# Altium project RegistrationModule.PrjPCB (part 4 of 4)

## Sheet Amplifier2ch.SchDoc
size A4; PageSetup: Record=PageOptions|CenterHorizontal=True|CenterVertical=True|PrintScale=0.97|XCorrection=1.00|YCorrection=1.00|PrintKind=2|BorderSize=5000000|LeftOffset=0|BottomOffset=0|Orientation=2|PaperLength=1270|PaperWidth=1000|Scale=100|PaperSource=4|PrintQuality=600|MediaType=1|DitherType=10|PaperKind=A4|PrintScaleMode=1
Used 16 times, as channels TopAmplifier/CH1, TopAmplifier/CH2, TopAmplifier/CH3, TopAmplifier/CH4, TopAmplifier/CH5, TopAmplifier/CH6, TopAmplifier/CH7, TopAmplifier/CH8, TopAmplifier/CH9, TopAmplifier/CH10, TopAmplifier/CH11, TopAmplifier/CH12, TopAmplifier/CH13, TopAmplifier/CH14, TopAmplifier/CH15, TopAmplifier/CH16. Parts and nets are listed once, with the designators drawn on the sheet.
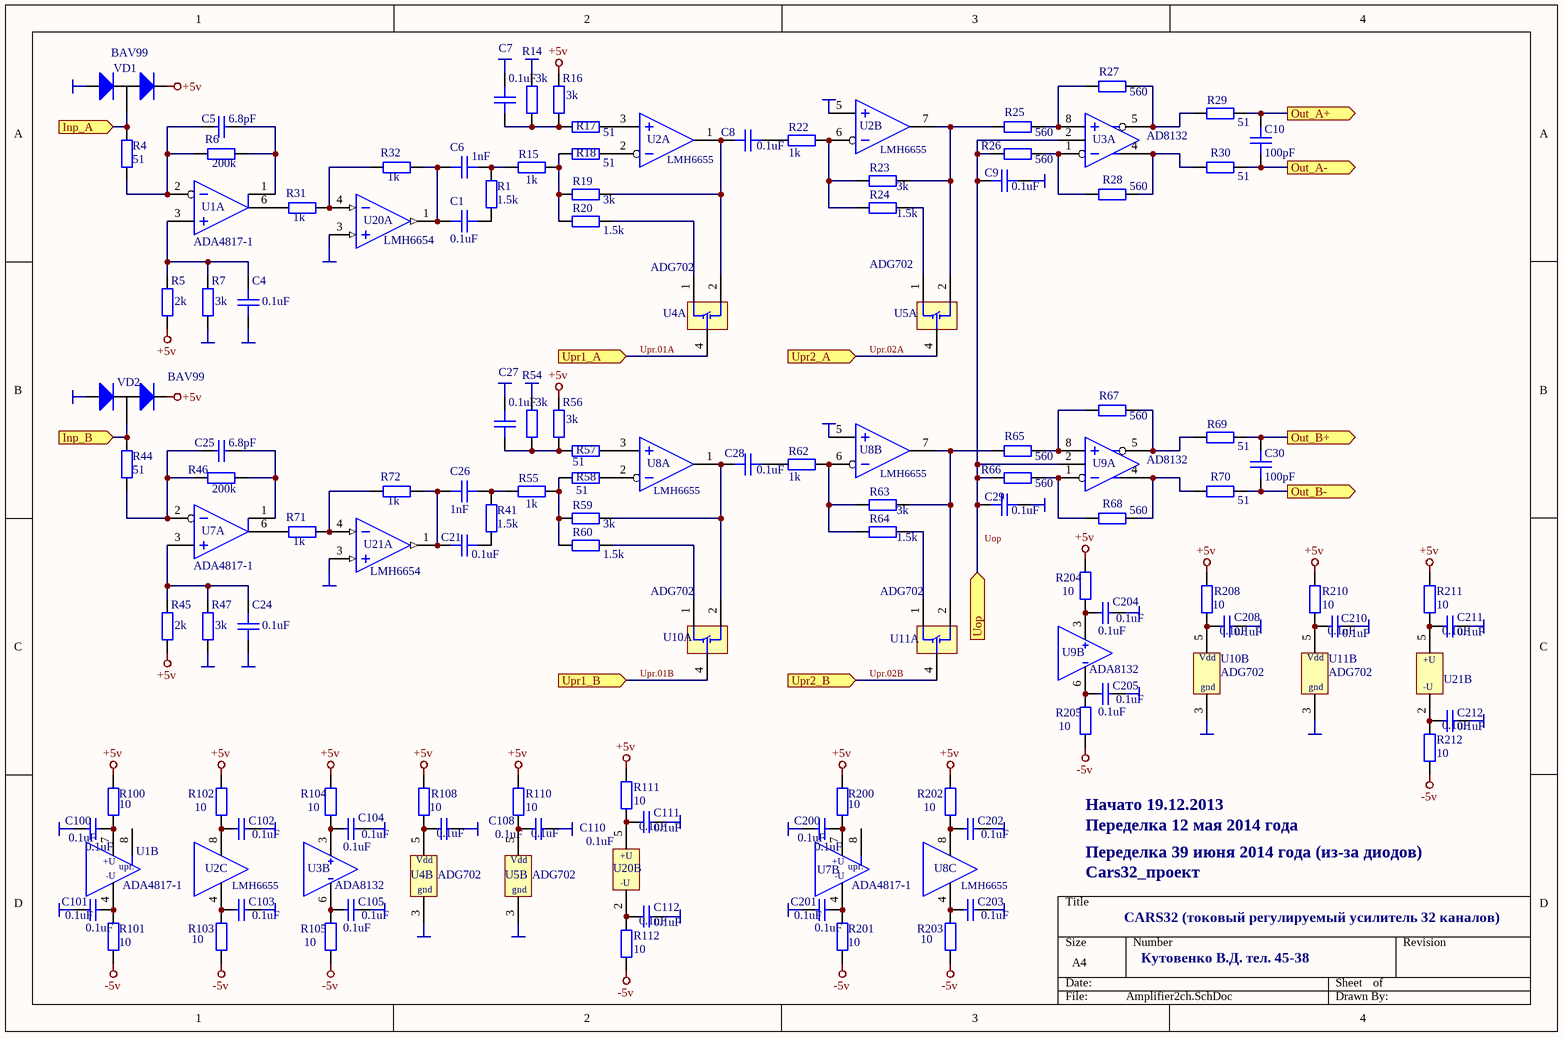
[diagram p11: Amplifier2ch.SchDoc]

### Parts
C1  0.1uF  [0603]
C4  0.1uF  [0603]
C5  6.8pF  [0603]
C6  1nF  [0603]
C7  0.1uF  [0603]
C8  0.1uF  [0603]
C9  0.1uF  [0603]
C10  100pF  [0603]
C21  0.1uF  [0603]
C24  0.1uF  [0603]
C25  6.8pF  [0603]
C26  1nF  [0603]
C27  0.1uF  [0603]
C28  0.1uF  [0603]
C29  0.1uF  [0603]
C30  100pF  [0603]
C100  0.1uF  [0603]
C101  0.1uF  [0603]
C102  0.1uF  [0603]
C103  0.1uF  [0603]
C104  0.1uF  [0603]
C105  0.1uF  [0603]
C108  0.1uF  [0603]
C110  0.1uF  [0603]
C111  0.1uF  [0603]
C112  0.1uF  [0603]
C200  0.1uF  [0603]
C201  0.1uF  [0603]
C202  0.1uF  [0603]
C203  0.1uF  [0603]
C204  0.1uF  [0603]
C205  0.1uF  [0603]
C208  0.1uF  [0603]
C210  0.1uF  [0603]
C211  0.1uF  [0603]
C212  0.1uF  [0603]
R1  1.5k  [0603]
R4  51  [0603]
R5  2k  [0603]
R6  200k  [0603]
R7  3k  [0603]
R14  3k  [0603]
R15  1k  [0603]
R16  3k  [0603]
R17  51  [0603]
R18  51  [0603]
R19  3k  [0603]
R20  1.5k  [0603]
R22  1k  [0603]
R23  3k  [0603]
R24  1.5k  [0603]
R25  560  [0603]
R26  560  [0603]
R27  560  [0603]
R28  560  [0603]
R29  51  [0603]
R30  51  [0603]
R31  1k  [0603]
R32  1k  [0603]
R41  1.5k  [0603]
R44  51  [0603]
R45  2k  [0603]
R46  200k  [0603]
R47  3k  [0603]
R54  3k  [0603]
R55  1k  [0603]
R56  3k  [0603]
R57  51  [0603]
R58  51  [0603]
R59  3k  [0603]
R60  1.5k  [0603]
R62  1k  [0603]
R63  3k  [0603]
R64  1.5k  [0603]
R65  560  [0603]
R66  560  [0603]
R67  560  [0603]
R68  560  [0603]
R69  51  [0603]
R70  51  [0603]
R71  1k  [0603]
R72  1k  [0603]
R100  10  [0603]
R101  10  [0603]
R102  10  [0603]
R103  10  [0603]
R104  10  [0603]
R105  10  [0603]
R108  10  [0603]
R110  10  [0603]
R111  10  [0603]
R112  10  [0603]
R200  10  [0603]
R201  10  [0603]
R202  10  [0603]
R203  10  [0603]
R204  10  [0603]
R205  10  [0603]
R208  10  [0603]
R210  10  [0603]
R211  10  [0603]
R212  10  [0603]
U1  ADA4817-1  [8SOIC150]  (parts A,B of 2)
U2  LMH6655  [8SOIC150]  (parts A,B,C of 3)
U3  AD8132  [8SOIC150]  (parts A,B of 2)
U4  ADG702  [SOT-23-5]  (parts A,B of 2)
U5  ADG702  [SOT-23-5]  (parts A,B of 2)
U7  ADA4817-1  [8SOIC150]  (parts A,B of 2)
U8  LMH6655  [8SOIC150]  (parts A,B,C of 3)
U9  AD8132  [8SOIC150]  (parts A,B of 2)
U10  ADG702  [SOT-23-5]  (parts A,B of 2)
U11  ADG702  [SOT-23-5]  (parts A,B of 2)
U20  LMH6654  [SOT-23-5]  (parts A,B of 2)
U21  LMH6654  [SOT-23-5]  (parts A,B of 2)
VD1  BAV99  [SOT-23]
VD2  BAV99  [SOT-23]

### Ports
Inp_A (in), Inp_B (in), Out_A+ (out), Out_A- (out), Out_B+ (out), Out_B- (out), Uop (in), Upr1_A (in), Upr1_B (in), Upr2_A (in), Upr2_B (in)

### Nets
+5v: R5.2 R16.2 R45.2 R56.2 R100.2 R102.2 R104.2 R108.2 R110.2 R111.2 R200.2 R202.2 R204.2 R208.2 R210.2 R211.2 VD1.2(K) VD2.2(K)
-5v: R101.1 R103.1 R105.1 R112.1 R201.1 R203.1 R205.1 R212.1
AGND: C4.1 C7.2 C9.1 C24.1 C27.2 C29.1 R7.1 R14.2 R47.1 R54.2 U2.5(IN+) U8.5(IN+) U20.3(IN+) U21.3(IN+) VD1.1(A) VD2.1(A)
GND: C100.1 C101.1 C102.2 C103.2 C104.2 C105.2 C108.1 C110.1 C111.1 C112.1 C200.1 C201.1 C202.2 C203.2 C204.2 C205.2 C208.1 C210.1 C211.1 C212.1 U4.3(GND) U5.3(GND) U10.3(GND) U11.3(GND)
Inp_A: R4.1 VD1.3(C) ; port Inp_A
Inp_B: R44.2 VD2.3(C) ; port Inp_B
Out_A+: C10.2 R29.2 ; port Out_A+
Out_A-: C10.1 R30.2 ; port Out_A-
Out_B+: C30.2 R69.2 ; port Out_B+
Out_B-: C30.1 R70.2 ; port Out_B-
Uop: C9.2 C29.2 R26.1 R66.1 U3.2 U9.2 ; port Uop
Upr.01A: U4.4(IN) ; port Upr1_A
Upr.01B: U10.4(IN) ; port Upr1_B
Upr.02A: U5.4(IN) ; port Upr2_A
Upr.02B: U11.4(IN) ; port Upr2_B
NetC1_1: C1.1 R1.2
NetC1_2: C1.2 C6.2 R32.2 U20.1(OUT)
NetC4_2: C4.2 R5.1 R7.2 U1.3(IN+)
NetC5_1: C5.1 R4.2 R6.1 U1.2(IN-)
NetC5_2: C5.2 R6.2 U1.1
NetC6_1: C6.1 R1.1 R15.1
NetC7_1: C7.1 R14.1 R16.1 R17.1
NetC8_1: C8.1 R19.2 U2.1(OUT) U4.2(S)
NetC8_2: C8.2 R22.1
NetC21_1: C21.1 C26.1 R72.2 U21.1(OUT)
NetC21_2: C21.2 R41.1
NetC24_2: C24.2 R45.1 R47.2 U7.3(IN+)
NetC25_1: C25.1 R44.1 R46.1 U7.2(IN-)
NetC25_2: C25.2 R46.2 U7.1
NetC26_2: C26.2 R41.2 R55.1
NetC27_1: C27.1 R54.1 R56.1 R57.2
NetC28_1: C28.1 R59.2 U8.1(OUT) U10.2(S)
NetC28_2: C28.2 R62.1
NetC100_2: C100.2 R100.1 U1.7(V+)
NetC101_2: C101.2 R101.2 U1.4(V-)
NetC102_1: C102.1 R102.1 U2.8(V+)
NetC103_1: C103.1 R103.2 U2.4(V-)
NetC104_1: C104.1 R104.1 U3.3(V+)
NetC105_1: C105.1 R105.2 U3.6(V-)
NetC108_2: C108.2 R108.1 U4.5(VDD)
NetC110_2: C110.2 R110.1 U5.5(VDD)
NetC111_2: C111.2 R111.1 U20.5(VDD)
NetC112_2: C112.2 R112.2 U20.2(GND)
NetC200_2: C200.2 R200.1 U7.7(V+)
NetC201_2: C201.2 R201.2 U7.4(V-)
NetC202_1: C202.1 R202.1 U8.8(V+)
NetC203_1: C203.1 R203.2 U8.4(V-)
NetC204_1: C204.1 R204.1 U9.3(V+)
NetC205_1: C205.1 R205.2 U9.6(V-)
NetC208_2: C208.2 R208.1 U10.5(VDD)
NetC210_2: C210.2 R210.1 U11.5(VDD)
NetC211_2: C211.2 R211.1 U21.5(VDD)
NetC212_2: C212.2 R212.2 U21.2(GND)
NetR15_2: R15.2 R18.1 R19.1 R20.1
NetR17_2: R17.2 U2.3(IN+)
NetR18_2: R18.2 U2.2(IN-)
NetR20_2: R20.2 U4.1(D)
NetR22_2: R22.2 R23.1 R24.1 U2.6(IN-)
NetR23_2: R23.2 R25.1 U2.7(OUT) U5.2(S)
NetR24_2: R24.2 U5.1(D)
NetR25_2: R25.2 R27.1 U3.8(IN+)
NetR26_2: R26.2 R28.1 U3.1(IN-)
NetR27_2: R27.2 R29.1 U3.5(OUT+)
NetR28_2: R28.2 R30.1 U3.4(OUT)
NetR31_1: R31.1 U1.6(OUT)
NetR31_2: R31.2 R32.1 U20.4(IN-)
NetR55_2: R55.2 R58.1 R59.1 R60.1
NetR57_1: R57.1 U8.3(IN+)
NetR58_2: R58.2 U8.2(IN-)
NetR60_2: R60.2 U10.1(D)
NetR62_2: R62.2 R63.1 R64.1 U8.6(IN-)
NetR63_2: R63.2 R65.1 U8.7(OUT) U11.2(S)
NetR64_2: R64.2 U11.1(D)
NetR65_2: R65.2 R67.1 U9.8(IN+)
NetR66_2: R66.2 R68.1 U9.1(IN-)
NetR67_2: R67.2 R69.1 U9.5(OUT+)
NetR68_2: R68.2 R70.1 U9.4(OUT)
NetR71_1: R71.1 U7.6(OUT)
NetR71_2: R71.2 R72.1 U21.4(IN-)

Not connected (* = marked no-connect by the designer): U1 8; U7 8

### Channels
TopAmplifier/CH1: designators end in _CH1; ports Inp_A=Ch0 Inp_B=Ch1 Out_A+=Adc0_In0+ Out_A-=Adc0_In0- Out_B+=Adc0_In1+ Out_B-=Adc0_In1- Uop=Uop1 Upr1_A=Ch0_GainCtrl0 Upr1_B=Ch1_GainCtrl0 Upr2_A=Ch0_GainCtrl1 Upr2_B=Ch1_GainCtrl1
TopAmplifier/CH2: designators end in _CH2; ports Inp_A=Ch2 Inp_B=Ch3 Out_A+=Adc0_In2+ Out_A-=Adc0_In2- Out_B+=Adc0_In3+ Out_B-=Adc0_In3- Uop=Uop1 Upr1_A=Ch2_GainCtrl0 Upr1_B=Ch3_GainCtrl0 Upr2_A=Ch2_GainCtrl1 Upr2_B=Ch3_GainCtrl1
TopAmplifier/CH3: designators end in _CH3; ports Inp_A=Ch4 Inp_B=Ch5 Out_A+=Adc0_In4+ Out_A-=Adc0_In4- Out_B+=Adc0_In5+ Out_B-=Adc0_In5- Uop=Uop1 Upr1_A=Ch4_GainCtrl0 Upr1_B=Ch5_GainCtrl0 Upr2_A=Ch4_GainCtrl1 Upr2_B=Ch5_GainCtrl1
TopAmplifier/CH4: designators end in _CH4; ports Inp_A=Ch6 Inp_B=Ch7 Out_A+=Adc0_In6+ Out_A-=Adc0_In6- Out_B+=Adc0_In7+ Out_B-=Adc0_In7- Uop=Uop1 Upr1_A=Ch6_GainCtrl0 Upr1_B=Ch7_GainCtrl0 Upr2_A=Ch6_GainCtrl1 Upr2_B=Ch7_GainCtrl1
TopAmplifier/CH5: designators end in _CH5; ports Inp_A=Ch8 Inp_B=Ch9 Out_A+=Adc1_In0+ Out_A-=Adc1_In0- Out_B+=Adc1_In1+ Out_B-=Adc1_In1- Uop=Uop5 Upr1_A=Ch8_GainCtrl0 Upr1_B=Ch9_GainCtrl0 Upr2_A=Ch8_GainCtrl1 Upr2_B=Ch9_GainCtrl1
TopAmplifier/CH6: designators end in _CH6; ports Inp_A=Ch10 Inp_B=Ch11 Out_A+=Adc1_In2+ Out_A-=Adc1_In2- Out_B+=Adc1_In3+ Out_B-=Adc1_In3- Uop=Uop5 Upr1_A=Ch10_GainCtrl0 Upr1_B=Ch11_GainCtrl0 Upr2_A=Ch10_GainCtrl1 Upr2_B=Ch11_GainCtrl1
TopAmplifier/CH7: designators end in _CH7; ports Inp_A=Ch12 Inp_B=Ch13 Out_A+=Adc1_In4+ Out_A-=Adc1_In4- Out_B+=Adc1_In5+ Out_B-=Adc1_In5- Uop=Uop5 Upr1_A=Ch12_GainCtrl0 Upr1_B=Ch13_GainCtrl0 Upr2_A=Ch12_GainCtrl1 Upr2_B=Ch13_GainCtrl1
TopAmplifier/CH8: designators end in _CH8; ports Inp_A=Ch14 Inp_B=Ch15 Out_A+=Adc1_In6+ Out_A-=Adc1_In6- Out_B+=Adc1_In7+ Out_B-=Adc1_In7- Uop=Uop5 Upr1_A=Ch14_GainCtrl0 Upr1_B=Ch15_GainCtrl0 Upr2_A=Ch14_GainCtrl1 Upr2_B=Ch15_GainCtrl1
TopAmplifier/CH9: designators end in _CH9; ports Inp_A=Ch16 Inp_B=Ch17 Out_A+=Adc2_In0+ Out_A-=Adc2_In0- Out_B+=Adc2_In1+ Out_B-=Adc2_In1- Uop=Uop10 Upr1_A=Ch16_GainCtrl0 Upr1_B=Ch17_GainCtrl0 Upr2_A=Ch16_GainCtrl1 Upr2_B=Ch17_GainCtrl1
TopAmplifier/CH10: designators end in _CH10; ports Inp_A=Ch18 Inp_B=Ch19 Out_A+=Adc2_In2+ Out_A-=Adc2_In2- Out_B+=Adc2_In3+ Out_B-=Adc2_In3- Uop=Uop10 Upr1_A=Ch18_GainCtrl0 Upr1_B=Ch19_GainCtrl0 Upr2_A=Ch18_GainCtrl1 Upr2_B=Ch19_GainCtrl1
TopAmplifier/CH11: designators end in _CH11; ports Inp_A=Ch20 Inp_B=Ch21 Out_A+=Adc2_In4+ Out_A-=Adc2_In4- Out_B+=Adc2_In5+ Out_B-=Adc2_In5- Uop=Uop10 Upr1_A=Ch20_GainCtrl0 Upr1_B=Ch21_GainCtrl0 Upr2_A=Ch20_GainCtrl1 Upr2_B=Ch21_GainCtrl1
TopAmplifier/CH12: designators end in _CH12; ports Inp_A=Ch22 Inp_B=Ch23 Out_A+=Adc2_In6+ Out_A-=Adc2_In6- Out_B+=Adc2_In7+ Out_B-=Adc2_In7- Uop=Uop10 Upr1_A=Ch22_GainCtrl0 Upr1_B=Ch23_GainCtrl0 Upr2_A=Ch22_GainCtrl1 Upr2_B=Ch23_GainCtrl1
TopAmplifier/CH13: designators end in _CH13; ports Inp_A=Ch24 Inp_B=Ch25 Out_A+=Adc3_In0+ Out_A-=Adc3_In0- Out_B+=Adc3_In1+ Out_B-=Adc3_In1- Uop=Uop13 Upr1_A=Ch24_GainCtrl0 Upr1_B=Ch25_GainCtrl0 Upr2_A=Ch24_GainCtrl1 Upr2_B=Ch25_GainCtrl1
TopAmplifier/CH14: designators end in _CH14; ports Inp_A=Ch26 Inp_B=Ch27 Out_A+=Adc3_In2+ Out_A-=Adc3_In2- Out_B+=Adc3_In3+ Out_B-=Adc3_In3- Uop=Uop13 Upr1_A=Ch26_GainCtrl0 Upr1_B=Ch27_GainCtrl0 Upr2_A=Ch26_GainCtrl1 Upr2_B=Ch27_GainCtrl1
TopAmplifier/CH15: designators end in _CH15; ports Inp_A=Ch28 Inp_B=Ch29 Out_A+=Adc3_In4+ Out_A-=Adc3_In4- Out_B+=Adc3_In5+ Out_B-=Adc3_In5- Uop=Uop13 Upr1_A=Ch28_GainCtrl0 Upr1_B=Ch29_GainCtrl0 Upr2_A=Ch28_GainCtrl1 Upr2_B=Ch29_GainCtrl1
TopAmplifier/CH16: designators end in _CH16; ports Inp_A=Ch30 Inp_B=Ch31 Out_A+=Adc3_In6+ Out_A-=Adc3_In6- Out_B+=Adc3_In7+ Out_B-=Adc3_In7- Uop=Uop13 Upr1_A=Ch30_GainCtrl0 Upr1_B=Ch31_GainCtrl0 Upr2_A=Ch30_GainCtrl1 Upr2_B=Ch31_GainCtrl1

### Notes on the sheet
- Начато 19.12.2013
- Переделка 12 мая 2014 года
- Cars32_проект
- Переделка 39 июня 2014 года (из-за диодов)
- CARS32 (токовый регулируемый усилитель 32 каналов)
- Кутовенко В.Д. тел. 45-38
- Labels drawn without touching a wire or pin: Uop
- (in symbol ADA4817-1, part B) +U; upr.; -U
- (in symbol ADG702, part B) Vdd; gnd
- (in symbol LMH6654, part B) +U; -U

### Library data of the parts
C1 C4 C6-C10 C21 C24 C26-C30 = C
  C1 C4 C7-C9 C21 C24 C27-C29: Value: 0.1uF
  C6 C26: Value: 1nF
  C10 C30: Value: 100pF
C5 C25 C100-C105 C108 C110-C112 C200-C205 C208 C210-C212 = Cap: Capacitor; Published: 8-Jun-2000; LatestRevisionDate: 17-Jul-2002; LatestRevisionNote: Re-released for DXP Platform.; PackageReference: RAD-0.3; Publisher: Altium Limited
  C5 C25: Value: 6.8pF
  C100-C105 C108 C110-C112 C200-C205 C208 C210-C212: Value: 0.1uF
R1 R4-R7 R14-R20 R22-R32 R41 R44-R47 R54-R60 R62-R72 R100-R105 R108 R110-R112 R200-R205 R208 R210-R212 = Res2: Resistor; Published: 8-Jun-2000; LatestRevisionDate: 17-Jul-2002; LatestRevisionNote: Re-released for DXP Platform.; PackageReference: AXIAL-0.4; Publisher: Altium Limited
  R1 R20 R24 R41 R60 R64: Value: 1.5k
  R4 R17 R18 R29 R30 R44 R57 R58 R69 R70: Value: 51
  R5 R45: Value: 2k
  R6 R46: Value: 200k
  R7 R14 R16 R19 R23 R47 R54 R56 R59 R63: Value: 3k
  R15 R22 R31 R32 R55 R62 R71 R72: Value: 1k
  R25-R28 R65-R68: Value: 560
  R100-R105 R108 R110-R112 R200-R205 R208 R210-R212: Value: 10
U1 U7 = ADA4817-1: Value: ADA4817-1
U2 U8 = LMH6655: Value: LMH6655
U3 U9 = AD8132: Value: AD8132; Published: 15-Apr-2002; LatestRevisionDate: 6-Jun-2005; LatestRevisionNote: Stylized 3D Model Added.; DatasheetDocument: Apr-1998; PackageDocument: Sep-1997; PackageReference: M08A; Publisher: Altium Limited; Code_JEDEC: MS-012-AA; Code_IPC: SO8; ComponentLink1Description: Manufacturer Link; ComponentLink1URL: http://www.national.com/
U4 U5 U10 U11 = ADG702: Value: ADG702
U20 U21 = LMH6654: Value: LMH6654
VD1 VD2 = BAV99: Value: BAV99

## Nets that join several sheets
+1.2v: PowerMeasure (R179.2), Power (C198.2 C206.+ U29.4 U29.5), FPGA (80 pins)
+2.3v: TopRegistrationModule (J3.A20 J3.A21 J3.B20 J3.B21), PowerMeasure (R173.2), Power (8 pins)
+2.5v: PowerMeasure (R178.2), Power (C199.2 C207.+ U30.4 U30.5), FPGA (38 pins)
+3.3v: TopRegistrationModule (J3.A16 J3.A17 J3.B16 J3.B17), Misc (13 pins), PowerMeasure (L20.2 R177.2), Memory (8 pins), Power (10 pins), FPGA (37 pins), Ethernet (10 pins)
+5.5v: TopRegistrationModule (J3.A23 J3.A24 J3.B23 J3.B24), PowerMeasure (L18.1 R172.2), Power (C176.+ C178.2 U25.2)
+5v: DigitalPart/ADC_0 (L3_ADC_0.1), DigitalPart/ADC_1 (L3_ADC_1.1), DigitalPart/ADC_2 (L3_ADC_2.1), DigitalPart/ADC_3 (L3_ADC_3.1), Power (C180.+ C182.2 R162.2 U25.4), TopAmplifier (5 pins), TopAmplifier/CH1 (18 pins), TopAmplifier/CH2 (18 pins), TopAmplifier/CH3 (18 pins), TopAmplifier/CH4 (18 pins), TopAmplifier/CH5 (18 pins), TopAmplifier/CH6 (18 pins), TopAmplifier/CH7 (18 pins), TopAmplifier/CH8 (18 pins), TopAmplifier/CH9 (18 pins), TopAmplifier/CH10 (18 pins), TopAmplifier/CH11 (18 pins), TopAmplifier/CH12 (18 pins), TopAmplifier/CH13 (18 pins), TopAmplifier/CH14 (18 pins), TopAmplifier/CH15 (18 pins), TopAmplifier/CH16 (18 pins)
-5.5v: TopRegistrationModule (J3.A26 J3.A27 J3.B26 J3.B27), PowerMeasure (L19.1 R165.1), Power (C177.- C179.2 U26.3 U26.6)
-5v: Power (C181.- C183.2 R163.2 U26.5), TopAmplifier (5 pins), TopAmplifier/CH1 (8 pins), TopAmplifier/CH2 (8 pins), TopAmplifier/CH3 (8 pins), TopAmplifier/CH4 (8 pins), TopAmplifier/CH5 (8 pins), TopAmplifier/CH6 (8 pins), TopAmplifier/CH7 (8 pins), TopAmplifier/CH8 (8 pins), TopAmplifier/CH9 (8 pins), TopAmplifier/CH10 (8 pins), TopAmplifier/CH11 (8 pins), TopAmplifier/CH12 (8 pins), TopAmplifier/CH13 (8 pins), TopAmplifier/CH14 (8 pins), TopAmplifier/CH15 (8 pins), TopAmplifier/CH16 (8 pins)
AdcAVDD: PowerMeasure (R174.2), DigitalPart/ADC_0 (L1_ADC_0.1), DigitalPart/ADC_1 (L1_ADC_1.1), DigitalPart/ADC_2 (L1_ADC_2.1), DigitalPart/ADC_3 (L1_ADC_3.1), Power (C166.+ C170.2 R154.2 U23.4)
AdcDVDD: DigitalPart/ADC_0 (L2_ADC_0.2), DigitalPart/ADC_1 (L2_ADC_1.2), DigitalPart/ADC_2 (L2_ADC_2.2), DigitalPart/ADC_3 (L2_ADC_3.2), Power (C167.+ C171.2 R155.2 U24.4), FPGA (R80.1 R81.1 R82.1 R83.1)
C_L1-PhD1: TopRegistrationModule (76 pins), Misc (43 pins), PowerMeasure (24 pins), Memory (6 pins), DigitalPart/ADC_0 (24 pins), DigitalPart/ADC_1 (24 pins), DigitalPart/ADC_2 (24 pins), DigitalPart/ADC_3 (24 pins), Power (47 pins), FPGA (229 pins), Ethernet (43 pins), TopAmplifier (14 pins), TopAmplifier/CH1 (40 pins), TopAmplifier/CH2 (40 pins), TopAmplifier/CH3 (40 pins), TopAmplifier/CH4 (40 pins), TopAmplifier/CH5 (40 pins), TopAmplifier/CH6 (40 pins), TopAmplifier/CH7 (40 pins), TopAmplifier/CH8 (40 pins), TopAmplifier/CH9 (40 pins), TopAmplifier/CH10 (40 pins), TopAmplifier/CH11 (40 pins), TopAmplifier/CH12 (40 pins), TopAmplifier/CH13 (40 pins), TopAmplifier/CH14 (40 pins), TopAmplifier/CH15 (40 pins), TopAmplifier/CH16 (40 pins)
HV: TopRegistrationModule (J3.A30 J3.B30), PowerMeasure (R164.1), Power (R151.1)
PhD_power: TopRegistrationModule (32 pins), Power (5 pins)
Adc0_Clk_n: Misc (R141.2 U18.41), DigitalPart/ADC_0 (C45_ADC_0.1 R42_ADC_0.1)
Adc0_Clk_p: Misc (R140.2 U18.42), DigitalPart/ADC_0 (C44_ADC_0.1 R42_ADC_0.2)
Adc0_D0_n: DigitalPart/ADC_0 (R43_ADC_0.2 U6_ADC_0.33), FPGA (U13.AB13)
Adc0_D0_p: DigitalPart/ADC_0 (R43_ADC_0.1 U6_ADC_0.34), FPGA (U13.AA13)
Adc0_D1_n: DigitalPart/ADC_0 (R48_ADC_0.2 U6_ADC_0.31), FPGA (U13.Y13)
Adc0_D1_p: DigitalPart/ADC_0 (R48_ADC_0.1 U6_ADC_0.32), FPGA (U13.W13)
Adc0_D2_n: DigitalPart/ADC_0 (R49_ADC_0.2 U6_ADC_0.29), FPGA (U13.AB14)
Adc0_D2_p: DigitalPart/ADC_0 (R49_ADC_0.1 U6_ADC_0.30), FPGA (U13.AA14)
Adc0_D3_n: DigitalPart/ADC_0 (R50_ADC_0.2 U6_ADC_0.27), FPGA (U13.Y15)
Adc0_D3_p: DigitalPart/ADC_0 (R50_ADC_0.1 U6_ADC_0.28), FPGA (U13.Y14)
Adc0_D4_n: DigitalPart/ADC_0 (R53_ADC_0.2 U6_ADC_0.21), FPGA (U13.AB16)
Adc0_D4_p: DigitalPart/ADC_0 (R53_ADC_0.1 U6_ADC_0.22), FPGA (U13.AA16)
Adc0_D5_n: DigitalPart/ADC_0 (R61_ADC_0.2 U6_ADC_0.19), FPGA (U13.AB17)
Adc0_D5_p: DigitalPart/ADC_0 (R61_ADC_0.1 U6_ADC_0.20), FPGA (U13.AA17)
Adc0_D6_n: DigitalPart/ADC_0 (R73_ADC_0.2 U6_ADC_0.17), FPGA (U13.Y17)
Adc0_D6_p: DigitalPart/ADC_0 (R73_ADC_0.1 U6_ADC_0.18), FPGA (U13.W17)
Adc0_D7_n: DigitalPart/ADC_0 (R74_ADC_0.2 U6_ADC_0.15), FPGA (U13.AB20)
Adc0_D7_p: DigitalPart/ADC_0 (R74_ADC_0.1 U6_ADC_0.16), FPGA (U13.AA20)
Adc0_Dco_n: DigitalPart/ADC_0 (R52_ADC_0.2 U6_ADC_0.23), FPGA (U13.W14)
Adc0_Dco_p: DigitalPart/ADC_0 (R52_ADC_0.1 U6_ADC_0.24), FPGA (U13.V13)
Adc0_Fco_n: DigitalPart/ADC_0 (R51_ADC_0.2 U6_ADC_0.25), FPGA (U13.AB15)
Adc0_Fco_p: DigitalPart/ADC_0 (R51_ADC_0.1 U6_ADC_0.26), FPGA (U13.AA15)
Adc0_In0+: DigitalPart/ADC_0 (U6_ADC_0.43), TopAmplifier/CH1 (C10_CH1.2 R29_CH1.2)
Adc0_In0-: DigitalPart/ADC_0 (U6_ADC_0.44), TopAmplifier/CH1 (C10_CH1.1 R30_CH1.2)
Adc0_In1+: DigitalPart/ADC_0 (U6_ADC_0.47), TopAmplifier/CH1 (C30_CH1.2 R69_CH1.2)
Adc0_In1-: DigitalPart/ADC_0 (U6_ADC_0.46), TopAmplifier/CH1 (C30_CH1.1 R70_CH1.2)
Adc0_In2+: DigitalPart/ADC_0 (U6_ADC_0.49), TopAmplifier/CH2 (C10_CH2.2 R29_CH2.2)
Adc0_In2-: DigitalPart/ADC_0 (U6_ADC_0.50), TopAmplifier/CH2 (C10_CH2.1 R30_CH2.2)
Adc0_In3+: DigitalPart/ADC_0 (U6_ADC_0.53), TopAmplifier/CH2 (C30_CH2.2 R69_CH2.2)
Adc0_In3-: DigitalPart/ADC_0 (U6_ADC_0.52), TopAmplifier/CH2 (C30_CH2.1 R70_CH2.2)
Adc0_In4+: DigitalPart/ADC_0 (U6_ADC_0.60), TopAmplifier/CH3 (C10_CH3.2 R29_CH3.2)
Adc0_In4-: DigitalPart/ADC_0 (U6_ADC_0.61), TopAmplifier/CH3 (C10_CH3.1 R30_CH3.2)
Adc0_In5+: DigitalPart/ADC_0 (U6_ADC_0.64), TopAmplifier/CH3 (C30_CH3.2 R69_CH3.2)
Adc0_In5-: DigitalPart/ADC_0 (U6_ADC_0.63), TopAmplifier/CH3 (C30_CH3.1 R70_CH3.2)
Adc0_In6+: DigitalPart/ADC_0 (U6_ADC_0.2), TopAmplifier/CH4 (C10_CH4.2 R29_CH4.2)
Adc0_In6-: DigitalPart/ADC_0 (U6_ADC_0.3), TopAmplifier/CH4 (C10_CH4.1 R30_CH4.2)
Adc0_In7+: DigitalPart/ADC_0 (U6_ADC_0.6), TopAmplifier/CH4 (C30_CH4.2 R69_CH4.2)
Adc0_In7-: DigitalPart/ADC_0 (U6_ADC_0.5), TopAmplifier/CH4 (C30_CH4.1 R70_CH4.2)
Adc0_nCS: DigitalPart/ADC_0 (U6_ADC_0.40), FPGA (R80.2 U13.V15)
Adc0_Vref: DigitalPart/ADC_0 (C47_ADC_0.2 R77_ADC_0.2 R78_ADC_0.2), TopAmplifier (R256.2 U31.3)
Adc1_Clk_n: Misc (R143.2 U18.38), DigitalPart/ADC_1 (C45_ADC_1.1 R42_ADC_1.1)
Adc1_Clk_p: Misc (R142.2 U18.39), DigitalPart/ADC_1 (C44_ADC_1.1 R42_ADC_1.2)
Adc1_D0_n: DigitalPart/ADC_1 (R43_ADC_1.2 U6_ADC_1.33), FPGA (U13.AA22)
Adc1_D0_p: DigitalPart/ADC_1 (R43_ADC_1.1 U6_ADC_1.34), FPGA (U13.AA21)
Adc1_D1_n: DigitalPart/ADC_1 (R48_ADC_1.2 U6_ADC_1.31), FPGA (U13.Y22)
Adc1_D1_p: DigitalPart/ADC_1 (R48_ADC_1.1 U6_ADC_1.32), FPGA (U13.Y21)
Adc1_D2_n: DigitalPart/ADC_1 (R49_ADC_1.2 U6_ADC_1.29), FPGA (U13.W22)
Adc1_D2_p: DigitalPart/ADC_1 (R49_ADC_1.1 U6_ADC_1.30), FPGA (U13.W21)
Adc1_D3_n: DigitalPart/ADC_1 (R50_ADC_1.2 U6_ADC_1.27), FPGA (U13.V22)
Adc1_D3_p: DigitalPart/ADC_1 (R50_ADC_1.1 U6_ADC_1.28), FPGA (U13.V21)
Adc1_D4_n: DigitalPart/ADC_1 (R53_ADC_1.2 U6_ADC_1.21), FPGA (U13.P22)
Adc1_D4_p: DigitalPart/ADC_1 (R53_ADC_1.1 U6_ADC_1.22), FPGA (U13.P21)
Adc1_D5_n: DigitalPart/ADC_1 (R61_ADC_1.2 U6_ADC_1.19), FPGA (U13.N22)
Adc1_D5_p: DigitalPart/ADC_1 (R61_ADC_1.1 U6_ADC_1.20), FPGA (U13.N21)
Adc1_D6_n: DigitalPart/ADC_1 (R73_ADC_1.2 U6_ADC_1.17), FPGA (U13.M20)
Adc1_D6_p: DigitalPart/ADC_1 (R73_ADC_1.1 U6_ADC_1.18), FPGA (U13.M19)
Adc1_D7_n: DigitalPart/ADC_1 (R74_ADC_1.2 U6_ADC_1.15), FPGA (U13.M22)
Adc1_D7_p: DigitalPart/ADC_1 (R74_ADC_1.1 U6_ADC_1.16), FPGA (U13.M21)
Adc1_Dco_n: DigitalPart/ADC_1 (R52_ADC_1.2 U6_ADC_1.23), FPGA (U13.N17)
Adc1_Dco_p: DigitalPart/ADC_1 (R52_ADC_1.1 U6_ADC_1.24), FPGA (U13.N18)
Adc1_Fco_n: DigitalPart/ADC_1 (R51_ADC_1.2 U6_ADC_1.25), FPGA (U13.T20)
Adc1_Fco_p: DigitalPart/ADC_1 (R51_ADC_1.1 U6_ADC_1.26), FPGA (U13.T19)
Adc1_In0+: DigitalPart/ADC_1 (U6_ADC_1.43), TopAmplifier/CH5 (C10_CH5.2 R29_CH5.2)
Adc1_In0-: DigitalPart/ADC_1 (U6_ADC_1.44), TopAmplifier/CH5 (C10_CH5.1 R30_CH5.2)
Adc1_In1+: DigitalPart/ADC_1 (U6_ADC_1.47), TopAmplifier/CH5 (C30_CH5.2 R69_CH5.2)
Adc1_In1-: DigitalPart/ADC_1 (U6_ADC_1.46), TopAmplifier/CH5 (C30_CH5.1 R70_CH5.2)
Adc1_In2+: DigitalPart/ADC_1 (U6_ADC_1.49), TopAmplifier/CH6 (C10_CH6.2 R29_CH6.2)
Adc1_In2-: DigitalPart/ADC_1 (U6_ADC_1.50), TopAmplifier/CH6 (C10_CH6.1 R30_CH6.2)
Adc1_In3+: DigitalPart/ADC_1 (U6_ADC_1.53), TopAmplifier/CH6 (C30_CH6.2 R69_CH6.2)
Adc1_In3-: DigitalPart/ADC_1 (U6_ADC_1.52), TopAmplifier/CH6 (C30_CH6.1 R70_CH6.2)
Adc1_In4+: DigitalPart/ADC_1 (U6_ADC_1.60), TopAmplifier/CH7 (C10_CH7.2 R29_CH7.2)
Adc1_In4-: DigitalPart/ADC_1 (U6_ADC_1.61), TopAmplifier/CH7 (C10_CH7.1 R30_CH7.2)
Adc1_In5+: DigitalPart/ADC_1 (U6_ADC_1.64), TopAmplifier/CH7 (C30_CH7.2 R69_CH7.2)
Adc1_In5-: DigitalPart/ADC_1 (U6_ADC_1.63), TopAmplifier/CH7 (C30_CH7.1 R70_CH7.2)
Adc1_In6+: DigitalPart/ADC_1 (U6_ADC_1.2), TopAmplifier/CH8 (C10_CH8.2 R29_CH8.2)
Adc1_In6-: DigitalPart/ADC_1 (U6_ADC_1.3), TopAmplifier/CH8 (C10_CH8.1 R30_CH8.2)
Adc1_In7+: DigitalPart/ADC_1 (U6_ADC_1.6), TopAmplifier/CH8 (C30_CH8.2 R69_CH8.2)
Adc1_In7-: DigitalPart/ADC_1 (U6_ADC_1.5), TopAmplifier/CH8 (C30_CH8.1 R70_CH8.2)
Adc1_nCS: DigitalPart/ADC_1 (U6_ADC_1.40), FPGA (R81.2 U13.U21)
Adc1_Vref: DigitalPart/ADC_1 (C47_ADC_1.2 R77_ADC_1.2 R78_ADC_1.2), TopAmplifier (R257.2 U32.3)
Adc2_Clk_n: Misc (R145.2 U18.32), DigitalPart/ADC_2 (C45_ADC_2.1 R42_ADC_2.1)
Adc2_Clk_p: Misc (R144.2 U18.33), DigitalPart/ADC_2 (C44_ADC_2.1 R42_ADC_2.2)
Adc2_D0_n: DigitalPart/ADC_2 (R43_ADC_2.2 U6_ADC_2.33), FPGA (U13.L22)
Adc2_D0_p: DigitalPart/ADC_2 (R43_ADC_2.1 U6_ADC_2.34), FPGA (U13.L21)
Adc2_D1_n: DigitalPart/ADC_2 (R48_ADC_2.2 U6_ADC_2.31), FPGA (U13.K22)
Adc2_D1_p: DigitalPart/ADC_2 (R48_ADC_2.1 U6_ADC_2.32), FPGA (U13.K21)
Adc2_D2_n: DigitalPart/ADC_2 (R49_ADC_2.2 U6_ADC_2.29), FPGA (U13.J22)
Adc2_D2_p: DigitalPart/ADC_2 (R49_ADC_2.1 U6_ADC_2.30), FPGA (U13.J21)
Adc2_D3_n: DigitalPart/ADC_2 (R50_ADC_2.2 U6_ADC_2.27), FPGA (U13.H22)
Adc2_D3_p: DigitalPart/ADC_2 (R50_ADC_2.1 U6_ADC_2.28), FPGA (U13.H21)
Adc2_D4_n: DigitalPart/ADC_2 (R53_ADC_2.2 U6_ADC_2.21), FPGA (U13.E22)
Adc2_D4_p: DigitalPart/ADC_2 (R53_ADC_2.1 U6_ADC_2.22), FPGA (U13.E21)
Adc2_D5_n: DigitalPart/ADC_2 (R61_ADC_2.2 U6_ADC_2.19), FPGA (U13.D22)
Adc2_D5_p: DigitalPart/ADC_2 (R61_ADC_2.1 U6_ADC_2.20), FPGA (U13.D21)
Adc2_D6_n: DigitalPart/ADC_2 (R73_ADC_2.2 U6_ADC_2.17), FPGA (U13.C22)
Adc2_D6_p: DigitalPart/ADC_2 (R73_ADC_2.1 U6_ADC_2.18), FPGA (U13.C21)
Adc2_D7_n: DigitalPart/ADC_2 (R74_ADC_2.2 U6_ADC_2.15), FPGA (U13.B22)
Adc2_D7_p: DigitalPart/ADC_2 (R74_ADC_2.1 U6_ADC_2.16), FPGA (U13.B21)
Adc2_Dco_n: DigitalPart/ADC_2 (R52_ADC_2.2 U6_ADC_2.23), FPGA (U13.C20)
Adc2_Dco_p: DigitalPart/ADC_2 (R52_ADC_2.1 U6_ADC_2.24), FPGA (U13.D20)
Adc2_Fco_n: DigitalPart/ADC_2 (R51_ADC_2.2 U6_ADC_2.25), FPGA (U13.F20)
Adc2_Fco_p: DigitalPart/ADC_2 (R51_ADC_2.1 U6_ADC_2.26), FPGA (U13.F19)
Adc2_In0+: DigitalPart/ADC_2 (U6_ADC_2.43), TopAmplifier/CH9 (C10_CH9.2 R29_CH9.2)
Adc2_In0-: DigitalPart/ADC_2 (U6_ADC_2.44), TopAmplifier/CH9 (C10_CH9.1 R30_CH9.2)
Adc2_In1+: DigitalPart/ADC_2 (U6_ADC_2.47), TopAmplifier/CH9 (C30_CH9.2 R69_CH9.2)
Adc2_In1-: DigitalPart/ADC_2 (U6_ADC_2.46), TopAmplifier/CH9 (C30_CH9.1 R70_CH9.2)
Adc2_In2+: DigitalPart/ADC_2 (U6_ADC_2.49), TopAmplifier/CH10 (C10_CH10.2 R29_CH10.2)
Adc2_In2-: DigitalPart/ADC_2 (U6_ADC_2.50), TopAmplifier/CH10 (C10_CH10.1 R30_CH10.2)
Adc2_In3+: DigitalPart/ADC_2 (U6_ADC_2.53), TopAmplifier/CH10 (C30_CH10.2 R69_CH10.2)
Adc2_In3-: DigitalPart/ADC_2 (U6_ADC_2.52), TopAmplifier/CH10 (C30_CH10.1 R70_CH10.2)
Adc2_In4+: DigitalPart/ADC_2 (U6_ADC_2.60), TopAmplifier/CH11 (C10_CH11.2 R29_CH11.2)
Adc2_In4-: DigitalPart/ADC_2 (U6_ADC_2.61), TopAmplifier/CH11 (C10_CH11.1 R30_CH11.2)
Adc2_In5+: DigitalPart/ADC_2 (U6_ADC_2.64), TopAmplifier/CH11 (C30_CH11.2 R69_CH11.2)
Adc2_In5-: DigitalPart/ADC_2 (U6_ADC_2.63), TopAmplifier/CH11 (C30_CH11.1 R70_CH11.2)
Adc2_In6+: DigitalPart/ADC_2 (U6_ADC_2.2), TopAmplifier/CH12 (C10_CH12.2 R29_CH12.2)
Adc2_In6-: DigitalPart/ADC_2 (U6_ADC_2.3), TopAmplifier/CH12 (C10_CH12.1 R30_CH12.2)
Adc2_In7+: DigitalPart/ADC_2 (U6_ADC_2.6), TopAmplifier/CH12 (C30_CH12.2 R69_CH12.2)
Adc2_In7-: DigitalPart/ADC_2 (U6_ADC_2.5), TopAmplifier/CH12 (C30_CH12.1 R70_CH12.2)
Adc2_nCS: DigitalPart/ADC_2 (U6_ADC_2.40), FPGA (R82.2 U13.J19)
Adc2_Vref: DigitalPart/ADC_2 (C47_ADC_2.2 R77_ADC_2.2 R78_ADC_2.2), TopAmplifier (R258.2 U33.3)
Adc3_Clk_n: Misc (R147.2 U18.28), DigitalPart/ADC_3 (C45_ADC_3.1 R42_ADC_3.1)
Adc3_Clk_p: Misc (R146.2 U18.29), DigitalPart/ADC_3 (C44_ADC_3.1 R42_ADC_3.2)
Adc3_D0_n: DigitalPart/ADC_3 (R43_ADC_3.2 U6_ADC_3.33), FPGA (U13.C19)
Adc3_D0_p: DigitalPart/ADC_3 (R43_ADC_3.1 U6_ADC_3.34), FPGA (U13.D19)
Adc3_D1_n: DigitalPart/ADC_3 (R48_ADC_3.2 U6_ADC_3.31), FPGA (U13.A18)
Adc3_D1_p: DigitalPart/ADC_3 (R48_ADC_3.1 U6_ADC_3.32), FPGA (U13.B18)
Adc3_D2_n: DigitalPart/ADC_3 (R49_ADC_3.2 U6_ADC_3.29), FPGA (U13.A17)
Adc3_D2_p: DigitalPart/ADC_3 (R49_ADC_3.1 U6_ADC_3.30), FPGA (U13.B17)
Adc3_D3_n: DigitalPart/ADC_3 (R50_ADC_3.2 U6_ADC_3.27), FPGA (U13.A16)
Adc3_D3_p: DigitalPart/ADC_3 (R50_ADC_3.1 U6_ADC_3.28), FPGA (U13.B16)
Adc3_D4_n: DigitalPart/ADC_3 (R53_ADC_3.2 U6_ADC_3.21), FPGA (U13.A15)
Adc3_D4_p: DigitalPart/ADC_3 (R53_ADC_3.1 U6_ADC_3.22), FPGA (U13.B15)
Adc3_D5_n: DigitalPart/ADC_3 (R61_ADC_3.2 U6_ADC_3.19), FPGA (U13.A14)
Adc3_D5_p: DigitalPart/ADC_3 (R61_ADC_3.1 U6_ADC_3.20), FPGA (U13.B14)
Adc3_D6_n: DigitalPart/ADC_3 (R73_ADC_3.2 U6_ADC_3.17), FPGA (U13.A13)
Adc3_D6_p: DigitalPart/ADC_3 (R73_ADC_3.1 U6_ADC_3.18), FPGA (U13.B13)
Adc3_D7_n: DigitalPart/ADC_3 (R74_ADC_3.2 U6_ADC_3.15), FPGA (U13.C13)
Adc3_D7_p: DigitalPart/ADC_3 (R74_ADC_3.1 U6_ADC_3.16), FPGA (U13.D13)
Adc3_Dco_n: DigitalPart/ADC_3 (R52_ADC_3.2 U6_ADC_3.23), FPGA (U13.E14)
Adc3_Dco_p: DigitalPart/ADC_3 (R52_ADC_3.1 U6_ADC_3.24), FPGA (U13.F13)
Adc3_Fco_n: DigitalPart/ADC_3 (R51_ADC_3.2 U6_ADC_3.25), FPGA (U13.D15)
Adc3_Fco_p: DigitalPart/ADC_3 (R51_ADC_3.1 U6_ADC_3.26), FPGA (U13.E15)
Adc3_In0+: DigitalPart/ADC_3 (U6_ADC_3.43), TopAmplifier/CH13 (C10_CH13.2 R29_CH13.2)
Adc3_In0-: DigitalPart/ADC_3 (U6_ADC_3.44), TopAmplifier/CH13 (C10_CH13.1 R30_CH13.2)
Adc3_In1+: DigitalPart/ADC_3 (U6_ADC_3.47), TopAmplifier/CH13 (C30_CH13.2 R69_CH13.2)
Adc3_In1-: DigitalPart/ADC_3 (U6_ADC_3.46), TopAmplifier/CH13 (C30_CH13.1 R70_CH13.2)
Adc3_In2+: DigitalPart/ADC_3 (U6_ADC_3.49), TopAmplifier/CH14 (C10_CH14.2 R29_CH14.2)
Adc3_In2-: DigitalPart/ADC_3 (U6_ADC_3.50), TopAmplifier/CH14 (C10_CH14.1 R30_CH14.2)
Adc3_In3+: DigitalPart/ADC_3 (U6_ADC_3.53), TopAmplifier/CH14 (C30_CH14.2 R69_CH14.2)
Adc3_In3-: DigitalPart/ADC_3 (U6_ADC_3.52), TopAmplifier/CH14 (C30_CH14.1 R70_CH14.2)
Adc3_In4+: DigitalPart/ADC_3 (U6_ADC_3.60), TopAmplifier/CH15 (C10_CH15.2 R29_CH15.2)
Adc3_In4-: DigitalPart/ADC_3 (U6_ADC_3.61), TopAmplifier/CH15 (C10_CH15.1 R30_CH15.2)
Adc3_In5+: DigitalPart/ADC_3 (U6_ADC_3.64), TopAmplifier/CH15 (C30_CH15.2 R69_CH15.2)
Adc3_In5-: DigitalPart/ADC_3 (U6_ADC_3.63), TopAmplifier/CH15 (C30_CH15.1 R70_CH15.2)
Adc3_In6+: DigitalPart/ADC_3 (U6_ADC_3.2), TopAmplifier/CH16 (C10_CH16.2 R29_CH16.2)
Adc3_In6-: DigitalPart/ADC_3 (U6_ADC_3.3), TopAmplifier/CH16 (C10_CH16.1 R30_CH16.2)
Adc3_In7+: DigitalPart/ADC_3 (U6_ADC_3.6), TopAmplifier/CH16 (C30_CH16.2 R69_CH16.2)
Adc3_In7-: DigitalPart/ADC_3 (U6_ADC_3.5), TopAmplifier/CH16 (C30_CH16.1 R70_CH16.2)
Adc3_nCS: DigitalPart/ADC_3 (U6_ADC_3.40), FPGA (R83.2 U13.C18)
Adc3_Vref: DigitalPart/ADC_3 (C47_ADC_3.2 R77_ADC_3.2 R78_ADC_3.2), TopAmplifier (R259.2 U34.3)
Adc_Pdwn: DigitalPart/ADC_0 (U6_ADC_0.41), DigitalPart/ADC_1 (U6_ADC_1.41), DigitalPart/ADC_2 (U6_ADC_2.41), DigitalPart/ADC_3 (U6_ADC_3.41), FPGA (R86.2 U13.W15)
Adc_Sclk: DigitalPart/ADC_0 (U6_ADC_0.38), DigitalPart/ADC_1 (U6_ADC_1.38), DigitalPart/ADC_2 (U6_ADC_2.38), DigitalPart/ADC_3 (U6_ADC_3.38), FPGA (R84.2 U13.U14)
Adc_Sdio: DigitalPart/ADC_0 (U6_ADC_0.39), DigitalPart/ADC_1 (U6_ADC_1.39), DigitalPart/ADC_2 (U6_ADC_2.39), DigitalPart/ADC_3 (U6_ADC_3.39), FPGA (R79.1)
AmplPwrOn: Power (R157.2 R158.1 R159.1), FPGA (U13.B2)
Ch0: TopRegistrationModule (R224.2), TopAmplifier/CH1 (R4_CH1.1 VD1_CH1.3)
Ch0_GainCtrl0: FPGA (U13.Y3), TopAmplifier/CH1 (U4_CH1.4)
Ch0_GainCtrl1: FPGA (U13.AA3), TopAmplifier/CH1 (U5_CH1.4)
Ch1: TopRegistrationModule (R225.2), TopAmplifier/CH1 (R44_CH1.2 VD2_CH1.3)
Ch1_GainCtrl0: FPGA (U13.Y4), TopAmplifier/CH1 (U10_CH1.4)
Ch1_GainCtrl1: FPGA (U13.AB3), TopAmplifier/CH1 (U11_CH1.4)
Ch2: TopRegistrationModule (R226.2), TopAmplifier/CH2 (R4_CH2.1 VD1_CH2.3)
Ch2_GainCtrl0: FPGA (U13.V6), TopAmplifier/CH2 (U4_CH2.4)
Ch2_GainCtrl1: FPGA (U13.AA4), TopAmplifier/CH2 (U5_CH2.4)
Ch3: TopRegistrationModule (R227.2), TopAmplifier/CH2 (R44_CH2.2 VD2_CH2.3)
Ch3_GainCtrl0: FPGA (U13.W6), TopAmplifier/CH2 (U10_CH2.4)
Ch3_GainCtrl1: FPGA (U13.AB4), TopAmplifier/CH2 (U11_CH2.4)
Ch4: TopRegistrationModule (R228.2), TopAmplifier/CH3 (R4_CH3.1 VD1_CH3.3)
Ch4_GainCtrl0: FPGA (U13.Y6), TopAmplifier/CH3 (U4_CH3.4)
Ch4_GainCtrl1: FPGA (U13.AA5), TopAmplifier/CH3 (U5_CH3.4)
Ch5: TopRegistrationModule (R229.2), TopAmplifier/CH3 (R44_CH3.2 VD2_CH3.3)
Ch5_GainCtrl0: FPGA (U13.V7), TopAmplifier/CH3 (U10_CH3.4)
Ch5_GainCtrl1: FPGA (U13.AB5), TopAmplifier/CH3 (U11_CH3.4)
Ch6: TopRegistrationModule (R230.2), TopAmplifier/CH4 (R4_CH4.1 VD1_CH4.3)
Ch6_GainCtrl0: FPGA (U13.W7), TopAmplifier/CH4 (U4_CH4.4)
Ch6_GainCtrl1: FPGA (U13.AA6), TopAmplifier/CH4 (U5_CH4.4)
Ch7: TopRegistrationModule (R231.2), TopAmplifier/CH4 (R44_CH4.2 VD2_CH4.3)
Ch7_GainCtrl0: FPGA (U13.Y7), TopAmplifier/CH4 (U10_CH4.4)
Ch7_GainCtrl1: FPGA (U13.AB6), TopAmplifier/CH4 (U11_CH4.4)
Ch8: TopRegistrationModule (R232.2), TopAmplifier/CH5 (R4_CH5.1 VD1_CH5.3)
Ch8_GainCtrl0: FPGA (U13.V8), TopAmplifier/CH5 (U4_CH5.4)
Ch8_GainCtrl1: FPGA (U13.AA7), TopAmplifier/CH5 (U5_CH5.4)
Ch9: TopRegistrationModule (R233.2), TopAmplifier/CH5 (R44_CH5.2 VD2_CH5.3)
Ch9_GainCtrl0: FPGA (U13.W8), TopAmplifier/CH5 (U10_CH5.4)
Ch9_GainCtrl1: FPGA (U13.AB7), TopAmplifier/CH5 (U11_CH5.4)
Ch10: TopRegistrationModule (R234.2), TopAmplifier/CH6 (R4_CH6.1 VD1_CH6.3)
Ch10_GainCtrl0: FPGA (U13.Y8), TopAmplifier/CH6 (U4_CH6.4)
Ch10_GainCtrl1: FPGA (U13.AA8), TopAmplifier/CH6 (U5_CH6.4)
Ch11: TopRegistrationModule (R235.2), TopAmplifier/CH6 (R44_CH6.2 VD2_CH6.3)
Ch11_GainCtrl0: FPGA (U13.V9), TopAmplifier/CH6 (U10_CH6.4)
Ch11_GainCtrl1: FPGA (U13.AB8), TopAmplifier/CH6 (U11_CH6.4)
Ch12: TopRegistrationModule (R236.2), TopAmplifier/CH7 (R4_CH7.1 VD1_CH7.3)
Ch12_GainCtrl0: FPGA (U13.V10), TopAmplifier/CH7 (U4_CH7.4)
Ch12_GainCtrl1: FPGA (U13.AA9), TopAmplifier/CH7 (U5_CH7.4)
Ch13: TopRegistrationModule (R237.2), TopAmplifier/CH7 (R44_CH7.2 VD2_CH7.3)
Ch13_GainCtrl0: FPGA (U13.W10), TopAmplifier/CH7 (U10_CH7.4)
Ch13_GainCtrl1: FPGA (U13.AB9), TopAmplifier/CH7 (U11_CH7.4)
Ch14: TopRegistrationModule (R238.2), TopAmplifier/CH8 (R4_CH8.1 VD1_CH8.3)
Ch14_GainCtrl0: FPGA (U13.Y10), TopAmplifier/CH8 (U4_CH8.4)
Ch14_GainCtrl1: FPGA (U13.AA10), TopAmplifier/CH8 (U5_CH8.4)
Ch15: TopRegistrationModule (R239.2), TopAmplifier/CH8 (R44_CH8.2 VD2_CH8.3)
Ch15_GainCtrl0: FPGA (U13.V11), TopAmplifier/CH8 (U10_CH8.4)
Ch15_GainCtrl1: FPGA (U13.AB10), TopAmplifier/CH8 (U11_CH8.4)
Ch16: TopRegistrationModule (R240.2), TopAmplifier/CH9 (R4_CH9.1 VD1_CH9.3)
Ch16_GainCtrl0: FPGA (U13.F10), TopAmplifier/CH9 (U4_CH9.4)
Ch16_GainCtrl1: FPGA (U13.A10), TopAmplifier/CH9 (U5_CH9.4)
Ch17: TopRegistrationModule (R241.2), TopAmplifier/CH9 (R44_CH9.2 VD2_CH9.3)
Ch17_GainCtrl0: FPGA (U13.E10), TopAmplifier/CH9 (U10_CH9.4)
Ch17_GainCtrl1: FPGA (U13.B10), TopAmplifier/CH9 (U11_CH9.4)
Ch18: TopRegistrationModule (R242.2), TopAmplifier/CH10 (R4_CH10.1 VD1_CH10.3)
Ch18_GainCtrl0: FPGA (U13.D10), TopAmplifier/CH10 (U4_CH10.4)
Ch18_GainCtrl1: FPGA (U13.A9), TopAmplifier/CH10 (U5_CH10.4)
Ch19: TopRegistrationModule (R243.2), TopAmplifier/CH10 (R44_CH10.2 VD2_CH10.3)
Ch19_GainCtrl0: FPGA (U13.F9), TopAmplifier/CH10 (U10_CH10.4)
Ch19_GainCtrl1: FPGA (U13.E9), TopAmplifier/CH10 (U11_CH10.4)
Ch20: TopRegistrationModule (R244.2), TopAmplifier/CH11 (R4_CH11.1 VD1_CH11.3)
Ch20_GainCtrl0: FPGA (U13.C10), TopAmplifier/CH11 (U4_CH11.4)
Ch20_GainCtrl1: FPGA (U13.B9), TopAmplifier/CH11 (U5_CH11.4)
Ch21: TopRegistrationModule (R245.2), TopAmplifier/CH11 (R44_CH11.2 VD2_CH11.3)
Ch21_GainCtrl0: FPGA (U13.F8), TopAmplifier/CH11 (U10_CH11.4)
Ch21_GainCtrl1: FPGA (U13.E8), TopAmplifier/CH11 (U11_CH11.4)
Ch22: TopRegistrationModule (R246.2), TopAmplifier/CH12 (R4_CH12.1 VD1_CH12.3)
Ch22_GainCtrl0: FPGA (U13.D8), TopAmplifier/CH12 (U4_CH12.4)
Ch22_GainCtrl1: FPGA (U13.A8), TopAmplifier/CH12 (U5_CH12.4)
Ch23: TopRegistrationModule (R247.2), TopAmplifier/CH12 (R44_CH12.2 VD2_CH12.3)
Ch23_GainCtrl0: FPGA (U13.C8), TopAmplifier/CH12 (U10_CH12.4)
Ch23_GainCtrl1: FPGA (U13.B8), TopAmplifier/CH12 (U11_CH12.4)
Ch24: TopRegistrationModule (R248.2), TopAmplifier/CH13 (R4_CH13.1 VD1_CH13.3)
Ch24_GainCtrl0: FPGA (U13.D7), TopAmplifier/CH13 (U4_CH13.4)
Ch24_GainCtrl1: FPGA (U13.E7), TopAmplifier/CH13 (U5_CH13.4)
Ch25: TopRegistrationModule (R249.2), TopAmplifier/CH13 (R44_CH13.2 VD2_CH13.3)
Ch25_GainCtrl0: FPGA (U13.F7), TopAmplifier/CH13 (U10_CH13.4)
Ch25_GainCtrl1: FPGA (U13.C7), TopAmplifier/CH13 (U11_CH13.4)
Ch26: TopRegistrationModule (R250.2), TopAmplifier/CH14 (R4_CH14.1 VD1_CH14.3)
Ch26_GainCtrl0: FPGA (U13.A7), TopAmplifier/CH14 (U4_CH14.4)
Ch26_GainCtrl1: FPGA (U13.D6), TopAmplifier/CH14 (U5_CH14.4)
Ch27: TopRegistrationModule (R251.2), TopAmplifier/CH14 (R44_CH14.2 VD2_CH14.3)
Ch27_GainCtrl0: FPGA (U13.E6), TopAmplifier/CH14 (U10_CH14.4)
Ch27_GainCtrl1: FPGA (U13.B7), TopAmplifier/CH14 (U11_CH14.4)
Ch28: TopRegistrationModule (R252.2), TopAmplifier/CH15 (R4_CH15.1 VD1_CH15.3)
Ch28_GainCtrl0: FPGA (U13.C6), TopAmplifier/CH15 (U4_CH15.4)
Ch28_GainCtrl1: FPGA (U13.A6), TopAmplifier/CH15 (U5_CH15.4)
Ch29: TopRegistrationModule (R253.2), TopAmplifier/CH15 (R44_CH15.2 VD2_CH15.3)
Ch29_GainCtrl0: FPGA (U13.B6), TopAmplifier/CH15 (U10_CH15.4)
Ch29_GainCtrl1: FPGA (U13.E5), TopAmplifier/CH15 (U11_CH15.4)
Ch30: TopRegistrationModule (R254.2), TopAmplifier/CH16 (R4_CH16.1 VD1_CH16.3)
Ch30_GainCtrl0: FPGA (U13.C4), TopAmplifier/CH16 (U4_CH16.4)
Ch30_GainCtrl1: FPGA (U13.A5), TopAmplifier/CH16 (U5_CH16.4)
Ch31: TopRegistrationModule (R255.2), TopAmplifier/CH16 (R44_CH16.2 VD2_CH16.3)
Ch31_GainCtrl0: FPGA (U13.B5), TopAmplifier/CH16 (U10_CH16.4)
Ch31_GainCtrl1: FPGA (U13.C3), TopAmplifier/CH16 (U11_CH16.4)
ClkGen_LD: Misc (R9.1), FPGA (U13.G5)
ClkGen_nCS: Misc (U18.14), FPGA (U13.J5)
ClkGen_nPD: Misc (R2.2), FPGA (U13.H6)
ClkGen_nRESET: Misc (R3.2), FPGA (U13.J6)
ClkGen_nSYNC: Misc (R8.2), FPGA (U13.H7)
ClkGen_RefClock_n: Misc (C127.2), FPGA (U13.U20)
ClkGen_RefClock_p: Misc (C126.2), FPGA (U13.U19)
ClkGen_REFMON: Misc (R11.1), FPGA (U13.G3)
ClkGen_SCLK: Misc (U18.13), FPGA (U13.J1)
ClkGen_SDIO: Misc (U18.16), FPGA (U13.J2)
ClkGen_SDO: Misc (U18.15), FPGA (U13.J3)
ClkGen_STATUS: Misc (R10.1), FPGA (U13.H5)
Clock25MHz: Misc (U19.3), FPGA (U13.T1)
Clock100MHz: Misc (C150.2 R149.1), FPGA (U13.AA12)
Eth_1: TopRegistrationModule (J3.B3), Ethernet (T1.1)
Eth_2: TopRegistrationModule (J3.A3), Ethernet (T1.3)
Eth_3: TopRegistrationModule (J3.B2), Ethernet (T1.6)
Eth_6: TopRegistrationModule (J3.A2), Ethernet (T1.8)
EthAddrSelect1: FPGA (U13.T11), Ethernet (R109.1 S1.16)
EthAddrSelect2: FPGA (U13.U11), Ethernet (R113.1 S1.15)
EthAddrSelect3: FPGA (U13.T10), Ethernet (R114.1 S1.14)
EthAddrSelect4: FPGA (U13.U10), Ethernet (R115.1 S1.13)
EthAddrSelect5: FPGA (U13.U9), Ethernet (R116.1 S1.12)
EthAddrSelect6: FPGA (U13.U8), Ethernet (R117.1 S1.11)
EthAddrSelect7: FPGA (U13.U7), Ethernet (R118.1 S1.10)
EthAddrSelect8: FPGA (U13.V5), Ethernet (R119.1 S1.9)
EthClock25MHz: FPGA (U13.E4), Ethernet (U15.1)
EthCOL: FPGA (U13.G4), Ethernet (U15.62)
EthCRS: FPGA (U13.E3), Ethernet (U15.63)
EthRX_CLK: FPGA (U13.J4), Ethernet (U15.52)
EthRX_DV: FPGA (U13.H3), Ethernet (U15.49)
EthRXD0: FPGA (U13.F2), Ethernet (U15.48)
EthRXD1: FPGA (U13.F1), Ethernet (U15.47)
EthRXD2: FPGA (U13.H2), Ethernet (U15.46)
EthRXD3: FPGA (U13.H1), Ethernet (U15.45)
EthTX_CLK: FPGA (U13.C2), Ethernet (U15.55)
EthTX_EN: FPGA (U13.H4), Ethernet (U15.56)
EthTXD0: FPGA (U13.E1), Ethernet (U15.57)
EthTXD1: FPGA (U13.D2), Ethernet (U15.58)
EthTXD2: FPGA (U13.C1), Ethernet (U15.59)
EthTXD3: FPGA (U13.B1), Ethernet (U15.60)
FRAM_A0: Memory (U16.5), FPGA (U13.M1)
FRAM_A1: Memory (U16.4), FPGA (U13.M2)
FRAM_A2: Memory (U16.3), FPGA (U13.N1)
FRAM_A3: Memory (U16.2), FPGA (U13.N2)
FRAM_A4: Memory (U16.1), FPGA (U13.P1)
FRAM_A5: Memory (U16.44), FPGA (U13.AA2)
FRAM_A6: Memory (U16.43), FPGA (U13.AA1)
FRAM_A7: Memory (U16.42), FPGA (U13.Y2)
FRAM_A8: Memory (U16.27), FPGA (U13.W2)
FRAM_A9: Memory (U16.26), FPGA (U13.W1)
FRAM_A10: Memory (U16.25), FPGA (U13.V2)
FRAM_A11: Memory (U16.24), FPGA (U13.V1)
FRAM_A12: Memory (U16.22), FPGA (U13.U2)
FRAM_A13: Memory (U16.21), FPGA (U13.U1)
FRAM_A14: Memory (U16.20), FPGA (U13.R2)
FRAM_A15: Memory (U16.19), FPGA (U13.R1)
FRAM_A16: Memory (U16.18), FPGA (U13.P2)
FRAM_D0: Memory (U16.7), FPGA (U13.M5)
FRAM_D1: Memory (U16.8), FPGA (U13.M3)
FRAM_D2: Memory (U16.9), FPGA (U13.M6)
FRAM_D3: Memory (U16.10), FPGA (U13.M4)
FRAM_D4: Memory (U16.13), FPGA (U13.N6)
FRAM_D5: Memory (U16.14), FPGA (U13.N5)
FRAM_D6: Memory (U16.15), FPGA (U13.P3)
FRAM_D7: Memory (U16.16), FPGA (U13.P5)
FRAM_D8: Memory (U16.29), FPGA (U13.P4)
FRAM_D9: Memory (U16.30), FPGA (U13.R3)
FRAM_D10: Memory (U16.31), FPGA (U13.R5)
FRAM_D11: Memory (U16.32), FPGA (U13.R4)
FRAM_D12: Memory (U16.35), FPGA (U13.T5)
FRAM_D13: Memory (U16.36), FPGA (U13.T4)
FRAM_D14: Memory (U16.37), FPGA (U13.V3)
FRAM_D15: Memory (U16.38), FPGA (U13.V4)
FRAM_nCE: Memory (R123.1 U16.6), FPGA (U13.P6)
FRAM_nOE: Memory (R125.1 U16.41), FPGA (U13.Y1)
FRAM_nWE: Memory (R124.1 U16.17), FPGA (U13.P7)
FRAM_nZZ: Memory (R126.1 U16.28), FPGA (U13.T3)
Hit_n: TopRegistrationModule (J3.A7), FPGA (U13.F17)
Hit_p: TopRegistrationModule (J3.B7), FPGA (U13.G17)
IdRead: Misc (R?.1 U17.1), FPGA (U13.G11)
nClock100MHz: Misc (C151.2 R149.2), FPGA (U13.AB12)
nLed0: Misc (R127.1), FPGA (U13.N7)
nLed1: Misc (R128.1), FPGA (U13.L6)
nVoltageCS: PowerMeasure (U28.1), FPGA (U13.A4)
Reserved_n: TopRegistrationModule (J3.A9), FPGA (R92.1 U13.G14)
Reserved_p: TopRegistrationModule (J3.B9), FPGA (R92.2 U13.G13)
Strobe_n: TopRegistrationModule (J3.A5), FPGA (R91.1 U13.E11)
Strobe_p: TopRegistrationModule (J3.B5), FPGA (R91.2 U13.F11)
ThermoSCL: Misc (R139.1 U22.4), FPGA (U13.J7)
ThermoSDA: Misc (R148.1 U22.5), FPGA (U13.K7)
Uop1: TopAmplifier (R264.2 U31.1), TopAmplifier/CH1 (6 pins), TopAmplifier/CH2 (6 pins), TopAmplifier/CH3 (6 pins), TopAmplifier/CH4 (6 pins)
Uop5: TopAmplifier (R265.2 U32.1), TopAmplifier/CH5 (6 pins), TopAmplifier/CH6 (6 pins), TopAmplifier/CH7 (6 pins), TopAmplifier/CH8 (6 pins)
Uop10: TopAmplifier (R266.2 U33.1), TopAmplifier/CH9 (6 pins), TopAmplifier/CH10 (6 pins), TopAmplifier/CH11 (6 pins), TopAmplifier/CH12 (6 pins)
Uop13: TopAmplifier (R267.2 U34.1), TopAmplifier/CH13 (6 pins), TopAmplifier/CH14 (6 pins), TopAmplifier/CH15 (6 pins), TopAmplifier/CH16 (6 pins)
VoltageDin: PowerMeasure (U28.14), FPGA (U13.B3)
VoltageDout: PowerMeasure (U28.15), FPGA (U13.A3)
VoltageSclk: PowerMeasure (U28.16), FPGA (U13.B4)